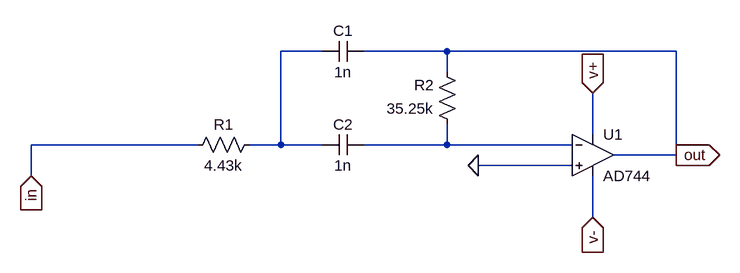
[diagram p0: schematic etj2.asc]
etj2.asc, the LTspice schematic file:
Version 4
SHEET 1 880 680
WIRE 112 96 48 96
WIRE 304 96 176 96
WIRE 656 96 304 96
WIRE 304 128 304 96
WIRE 528 224 528 160
WIRE -80 240 -336 240
WIRE 48 240 48 96
WIRE 48 240 0 240
WIRE 112 240 48 240
WIRE 304 240 304 208
WIRE 304 240 176 240
WIRE 496 240 304 240
WIRE 656 256 656 96
WIRE 656 256 560 256
WIRE 496 272 352 272
WIRE -336 288 -336 240
WIRE 528 352 528 288
FLAG 352 272 0
FLAG -336 288 in
IOPIN -336 288 In
FLAG 656 256 out
IOPIN 656 256 Out
FLAG 528 160 v+
IOPIN 528 160 In
FLAG 528 352 v-
IOPIN 528 352 In
DATAFLAG -176 240 ""
DATAFLAG 80 240 ""
DATAFLAG 352 240 ""
DATAFLAG 432 272 ""
DATAFLAG 624 256 ""
SYMBOL cap 176 112 M270
WINDOW 0 32 32 VTop 2
WINDOW 3 0 32 VBottom 2
SYMATTR InstName C1
SYMATTR Value 1n
SYMBOL res 16 224 R90
WINDOW 0 0 56 VBottom 2
WINDOW 3 32 56 VTop 2
SYMATTR InstName R1
SYMATTR Value 4.43k
SYMBOL res 320 224 R180
WINDOW 0 36 76 Left 2
WINDOW 3 36 40 Left 2
SYMATTR InstName R2
SYMATTR Value 35.25k
SYMBOL cap 112 256 R270
WINDOW 0 32 32 VTop 2
WINDOW 3 0 32 VBottom 2
SYMATTR InstName C2
SYMATTR Value 1n
SYMBOL OpAmps\\AD744 528 192 R0
SYMATTR InstName U1

The netlist it stands for:
* etj2.asc
C1 out N001 1n
R1 N001 in 4.43k
R2 N002 out 35.25k
C2 N001 N002 1n
XU1 0 N002 v+ v- out AD744  ; pins In+ In- V+ V- OUT
.backanno
.end